# Altium schematic sheet PC_Microcontroller_Power.SchDoc: Payload Computer - Microcontroller Power
size A3; Engineer: Matt Brindley; Organization: BLUEsat Project; Address1: Room 419; Address2: School of EE&T; Address3: UNSW, NSW 2052; Address4: Australia
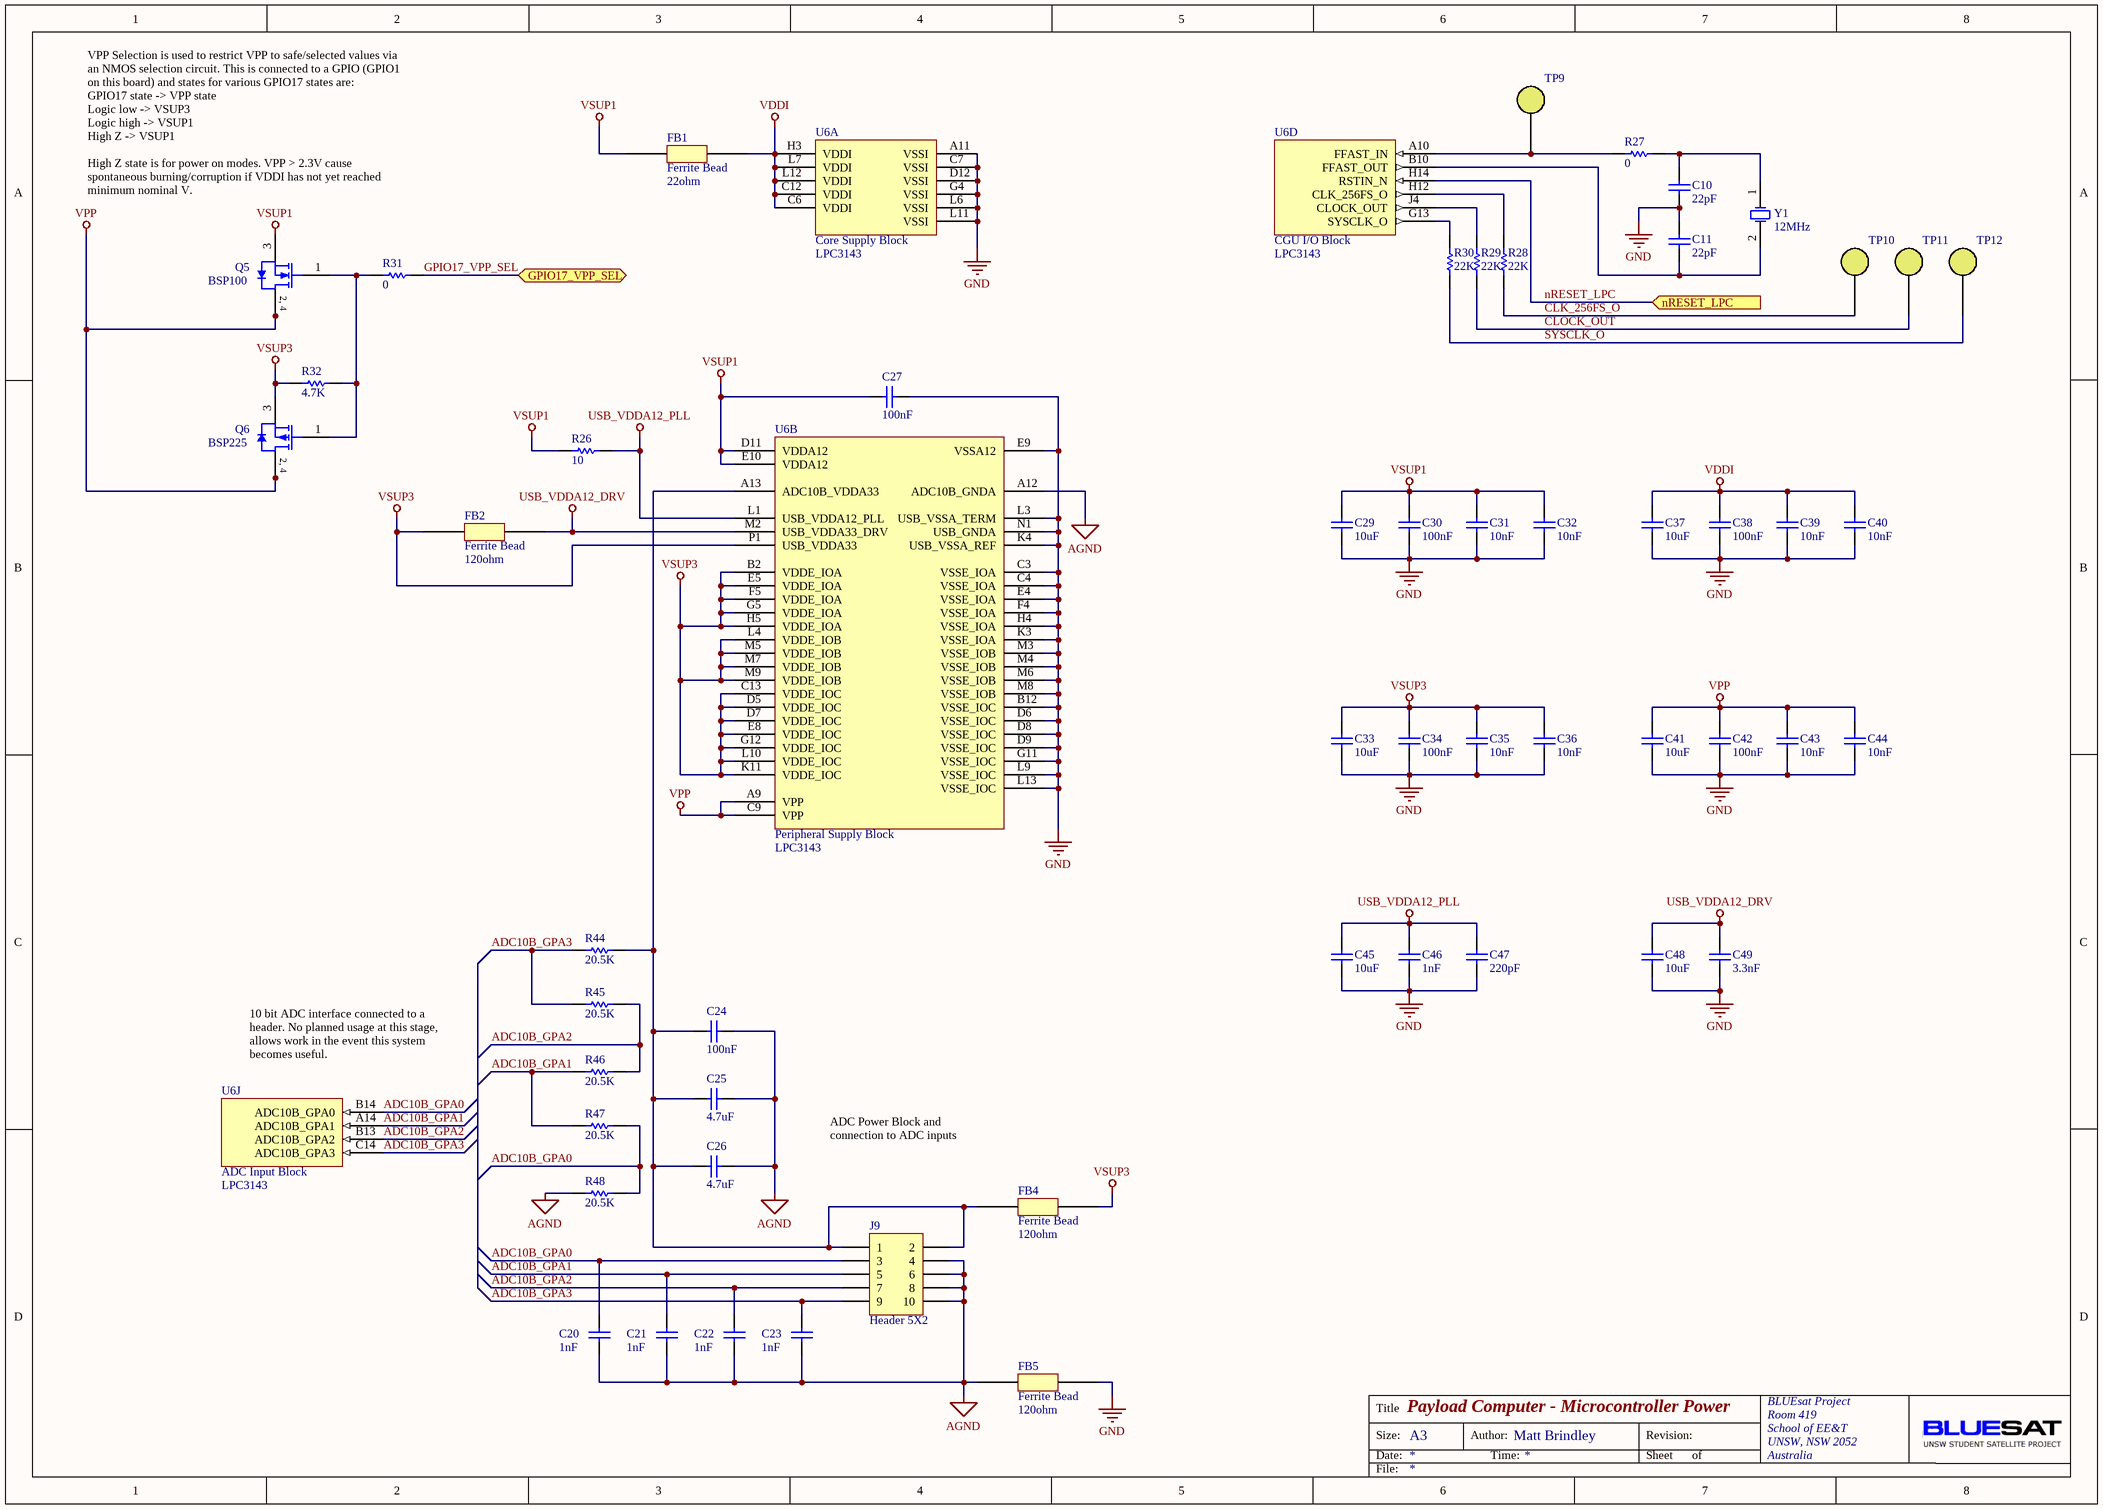
[diagram p0: PC_Microcontroller_Power.SchDoc]

## Parts
C10  value 22pF  [C0805]  (hidden comment: Cap Semi)
C11  value 22pF  [C0805]  (hidden comment: Cap Semi)
C20  value 1nF  [C0805]  (hidden comment: Cap Semi)
C21  value 1nF  [C0805]  (hidden comment: Cap Semi)
C22  value 1nF  [C0805]  (hidden comment: Cap Semi)
C23  value 1nF  [C0805]  (hidden comment: Cap Semi)
C24  value 100nF  [C0805]  (hidden comment: Cap Semi)
C25  value 4.7uF  [C0805]  (hidden comment: Cap Semi)
C26  value 4.7uF  [C0805]  (hidden comment: Cap Semi)
C27  value 100nF  [C0805]  (hidden comment: Cap Semi)
C29  value 10uF  [C0805]  (hidden comment: Cap Semi)
C30  value 100nF  [C0805]  (hidden comment: Cap Semi)
C31  value 10nF  [C0805]  (hidden comment: Cap Semi)
C32  value 10nF  [C0805]  (hidden comment: Cap Semi)
C33  value 10uF  [C0805]  (hidden comment: Cap Semi)
C34  value 100nF  [C0805]  (hidden comment: Cap Semi)
C35  value 10nF  [C0805]  (hidden comment: Cap Semi)
C36  value 10nF  [C0805]  (hidden comment: Cap Semi)
C37  value 10uF  [C0805]  (hidden comment: Cap Semi)
C38  value 100nF  [C0805]  (hidden comment: Cap Semi)
C39  value 10nF  [C0805]  (hidden comment: Cap Semi)
C40  value 10nF  [C0805]  (hidden comment: Cap Semi)
C41  value 10uF  [C0805]  (hidden comment: Cap Semi)
C42  value 100nF  [C0805]  (hidden comment: Cap Semi)
C43  value 10nF  [C0805]  (hidden comment: Cap Semi)
C44  value 10nF  [C0805]  (hidden comment: Cap Semi)
C45  value 10uF  [C0805]  (hidden comment: Cap Semi)
C46  value 1nF  [C0805]  (hidden comment: Cap Semi)
C47  value 220pF  [C0805]  (hidden comment: Cap Semi)
C48  value 10uF  [C0805]  (hidden comment: Cap Semi)
C49  value 3.3nF  [C0805]  (hidden comment: Cap Semi)
FB1  Ferrite Bead  value 22ohm  [AXIAL-0.3]
FB2  Ferrite Bead  value 120ohm  [AXIAL-0.3]
FB4  Ferrite Bead  value 120ohm  [AXIAL-0.3]
FB5  Ferrite Bead  value 120ohm  [AXIAL-0.3]
J9  Header 5X2  [HDR2X5]
Q5  BSP100  [SOT223_N]
Q6  BSP225  [SOT223_N]
R26  value 10  [6-0805_L]  (hidden comment: Res Semi)
R27  value 0  [6-0805_L]  (hidden comment: Res Semi)
R28  value 22K  [6-0805_L]  (hidden comment: Res Semi)
R29  value 22K  [6-0805_L]  (hidden comment: Res Semi)
R30  value 22K  [6-0805_L]  (hidden comment: Res Semi)
R31  value 0  [6-0805_L]  (hidden comment: Res Semi)
R32  value 4.7K  [6-0805_L]  (hidden comment: Res Semi)
R44  value 20.5K  [6-0805_L]  (hidden comment: Res Semi)
R45  value 20.5K  [6-0805_L]  (hidden comment: Res Semi)
R46  value 20.5K  [6-0805_L]  (hidden comment: Res Semi)
R47  value 20.5K  [6-0805_L]  (hidden comment: Res Semi)
R48  value 20.5K  [6-0805_L]  (hidden comment: Res Semi)
TP9  Test Point  [PIN1]  (value not drawn)
TP10  Test Point  [PIN1]  (value not drawn)
TP11  Test Point  [PIN1]  (value not drawn)
TP12  Test Point  [PIN1]  (value not drawn)
U6  LPC3143  [BGA180C80P14X14_1200X1200X120]  (parts A,B,D,J of 11)
Y1  value 12MHz  [RAD-0.3]  (hidden comment: XTAL)

## Ports
GPIO17_VPP_SEL (bidir), nRESET_LPC (in)

## Nets
AGND: C20.1 C21.1 C22.1 C23.1 C24.1 C25.1 C26.1 FB5.2 J9.4 J9.6 J9.8 J9.10 R48.1 U6.A12(ADC10B_GNDA)
GND: C10.2 C11.1 C27.1 C29.2 C30.2 C31.2 C32.2 C33.2 C34.2 C35.2 C36.2 C37.2 C38.2 C39.2 C40.2 C41.2 C42.2 C43.2 C44.2 C45.2 C46.2 C47.2 C48.2 C49.2 FB5.1 U6.A11(VSSI) U6.B12(VSSE_IOC) U6.C3(VSSE_IOA) U6.C4(VSSE_IOA) U6.C7(VSSI) U6.D6(VSSE_IOC) U6.D8(VSSE_IOC) U6.D9(VSSE_IOC) U6.D12(VSSI) U6.E4(VSSE_IOA) U6.E9(VSSA12) U6.F4(VSSE_IOA) U6.G4(VSSI) U6.G11(VSSE_IOC) U6.H4(VSSE_IOA) U6.K3(VSSE_IOA) U6.K4(USB_VSSA_REF) U6.L3(USB_VSSA_TERM) U6.L6(VSSI) U6.L9(VSSE_IOC) U6.L11(VSSI) U6.L13(VSSE_IOC) U6.M3(VSSE_IOB) U6.M4(VSSE_IOB) U6.M6(VSSE_IOB) U6.M8(VSSE_IOB) U6.N1(USB_GNDA)
USB_VDDA12_DRV: C48.1 C49.1 FB2.1 U6.M2(USB_VDDA33_DRV)
USB_VDDA12_PLL: C45.1 C46.1 C47.1 R26.2 U6.L1(USB_VDDA12_PLL)
VDDI: C37.1 C38.1 C39.1 C40.1 FB1.1 U6.C6(VDDI) U6.C12(VDDI) U6.H3(VDDI) U6.L7(VDDI) U6.L12(VDDI)
VPP: C41.1 C42.1 C43.1 C44.1 Q5.2(D) Q5.4(D) Q6.2(D) Q6.4(D) U6.A9(VPP) U6.C9(VPP)
VSUP1: C27.2 C29.1 C30.1 C31.1 C32.1 FB1.2 Q5.3(S) R26.1 U6.D11(VDDA12) U6.E10(VDDA12)
VSUP3: C33.1 C34.1 C35.1 C36.1 FB2.2 FB4.1 Q6.3(S) R32.1 U6.B2(VDDE_IOA) U6.C13(VDDE_IOC) U6.D5(VDDE_IOC) U6.D7(VDDE_IOC) U6.E5(VDDE_IOA) U6.E8(VDDE_IOC) U6.F5(VDDE_IOA) U6.G5(VDDE_IOA) U6.G12(VDDE_IOC) U6.H5(VDDE_IOA) U6.K11(VDDE_IOC) U6.L4(VDDE_IOB) U6.L10(VDDE_IOC) U6.M5(VDDE_IOB) U6.M7(VDDE_IOB) U6.M9(VDDE_IOB) U6.P1(USB_VDDA33)
ADC10B_GPA0: C20.2 J9.3 R47.2 R48.2 U6.B14(ADC10B_GPA0)
ADC10B_GPA1: C21.2 J9.5 R46.1 R47.1 U6.A14(ADC10B_GPA1)
ADC10B_GPA2: C22.2 J9.7 R45.2 R46.2 U6.B13(ADC10B_GPA2)
ADC10B_GPA3: C23.2 J9.9 R44.1 R45.1 U6.C14(ADC10B_GPA3)
CLK_256FS_O: R28.1 TP10.1
CLOCK_OUT: R29.1 TP11.1
GPIO17_VPP_SEL: R31.2 ; port GPIO17_VPP_SEL
nRESET_LPC: U6.H14(RSTIN_N) ; port nRESET_LPC
SYSCLK_O: R30.1 TP12.1
NetC10_1: C10.1 R27.2 Y1.1(OSC1)
NetC11_2: C11.2 U6.B10(FFAST_OUT) Y1.2(OSC2)
NetC24_2: C24.2 C25.2 C26.2 FB4.2 J9.1 J9.2 R44.2 U6.A13(ADC10B_VDDA33)
NetQ5_1: Q5.1(G) Q6.1(G) R31.1 R32.2
NetR27_1: R27.1 TP9.1 U6.A10(FFAST_IN)
NetR28_2: R28.2 U6.H12(CLK_256FS_O)
NetR29_2: R29.2 U6.J4(CLOCK_OUT)
NetR30_2: R30.2 U6.G13(SYSCLK_O)

## Notes on the sheet
- VPP Selection is used to restrict VPP to safe/selected values via an NMOS selection circuit. This is connected to a GPIO (GPIO1 on this board) and states for various GPIO17 states are:
  GPIO17 state -> VPP state
  Logic low -> VSUP3
  Logic high -> VSUP1
  High Z -> VSUP1
  High Z state is for power on modes. VPP > 2.3V cause spontaneous burning/corruption if VDDI has not yet reached minimum nominal V.
- 10 bit ADC interface connected to a header. No planned usage at this stage, allows work in the event this system becomes useful.
- ADC Power Block and connection to ADC inputs
- Title
- Size:
- Date:
- A3
- Author:
- Time:
- Revision:
- Sheet
- of
- File:
- (in symbol BSP100) 2, 4
- (in symbol BSP225) 2, 4
- (in symbol LPC3143, part A) Core Supply Block
- (in symbol LPC3143, part B) Peripheral Supply Block
- (in symbol LPC3143, part D) CGU I/O Block
- (in symbol LPC3143, part J) ADC Input Block

## Library data of the parts
C10 C11 C20-C27 C29-C49 = Cap Semi: Capacitor (Semiconductor SIM Model); Published: 8-Jun-2000; LatestRevisionDate: 29-May-2009; LatestRevisionNote: IPC-7351 Footprint Added.; PackageReference: C1206; Publisher: Altium Limited; PackageDescription: Chip Capacitor
FB1 FB2 FB4 FB5 = Ferrite Bead: Standard Ferrite Bead; Published: 8-Jun-2000; LatestRevisionDate: 08-Jul-2005; LatestRevisionNote: Mech Layer 1 removed.; PackageReference: LED-0; Publisher: Altium Limited
J9 = Header 5X2: Header, 5-Pin, Dual row; LatestRevisionDate: 17-Jul-2002; LatestRevisionNote: Re-released for DXP Platform.; Publisher: Altium Limited
Q5 = BSP100: N-channel Enhancement Mode MOSFET; Published: 17-Sep-2003; LatestRevisionDate: 12-Dec-2006; LatestRevisionNote: IPC-7351 Footprint Added.; DatasheetVersion: Feb-1999; PackageVersion: Aug-2001; PackageReference: SOT223; Publisher: Altium Limited; PackageDescription: 4-Pin SOT-223 Package 2.3 mm Pitch, 7 mm Lead Span; ComponentLink1Description: Manufacturer Link; ComponentLink1URL: http://www.semiconductors.philips.com/; ComponentLink2Description: Datasheet; ComponentLink2URL: http://www.semiconductors.philips.com/acrobat/datasheets/BSP100_3.pdf
Q6 = BSP225: P-channel Enhancement Mode Vertical D-MOSFET; Published: 17-Sep-2003; LatestRevisionDate: 12-Dec-2006; LatestRevisionNote: IPC-7351 Footprint Added.; DatasheetVersion: Apr-1995; PackageVersion: Aug-2001; PackageReference: SOT223; Publisher: Altium Limited; PackageDescription: 4-Pin SOT-223 Package 2.3 mm Pitch, 7 mm Lead Span; ComponentLink1Description: Manufacturer Link; ComponentLink1URL: http://www.semiconductors.philips.com/; ComponentLink2Description: Datasheet; ComponentLink2URL: http://www.semiconductors.philips.com/acrobat/datasheets/BSP225_CNV_2.pdf
R26-R32 R44-R48 = Res Semi: Semiconductor Resistor; Published: 8-Jun-2000; LatestRevisionDate: 17-Jul-2002; LatestRevisionNote: Re-released for DXP Platform.; PackageReference: AXIAL-0.5; Publisher: Altium Limited
U6 = LPC3143: NXP ARM9 based microcontroller; Published: N/A; LatestRevisionDate: 09/03/2010; LatestRevisionNote: Created; PackageReference: BGA; Publisher: BLUEsat Project
Y1 = XTAL: Crystal Oscillator; Published: 8-Jun-2000; LatestRevisionDate: 17-Jul-2002; LatestRevisionNote: Re-released for DXP Platform.; PackageReference: R38; Publisher: Altium Limited
TP9-TP12 = Test Point: Published: 8-Jun-2000; LatestRevisionDate: 08-Jul-2005; LatestRevisionNote: Mech Layer 1 removed.; PackageReference: LED-0; Publisher: Altium Limited